# EAGLE design AG_TEX (EAGLE 6.5.0)
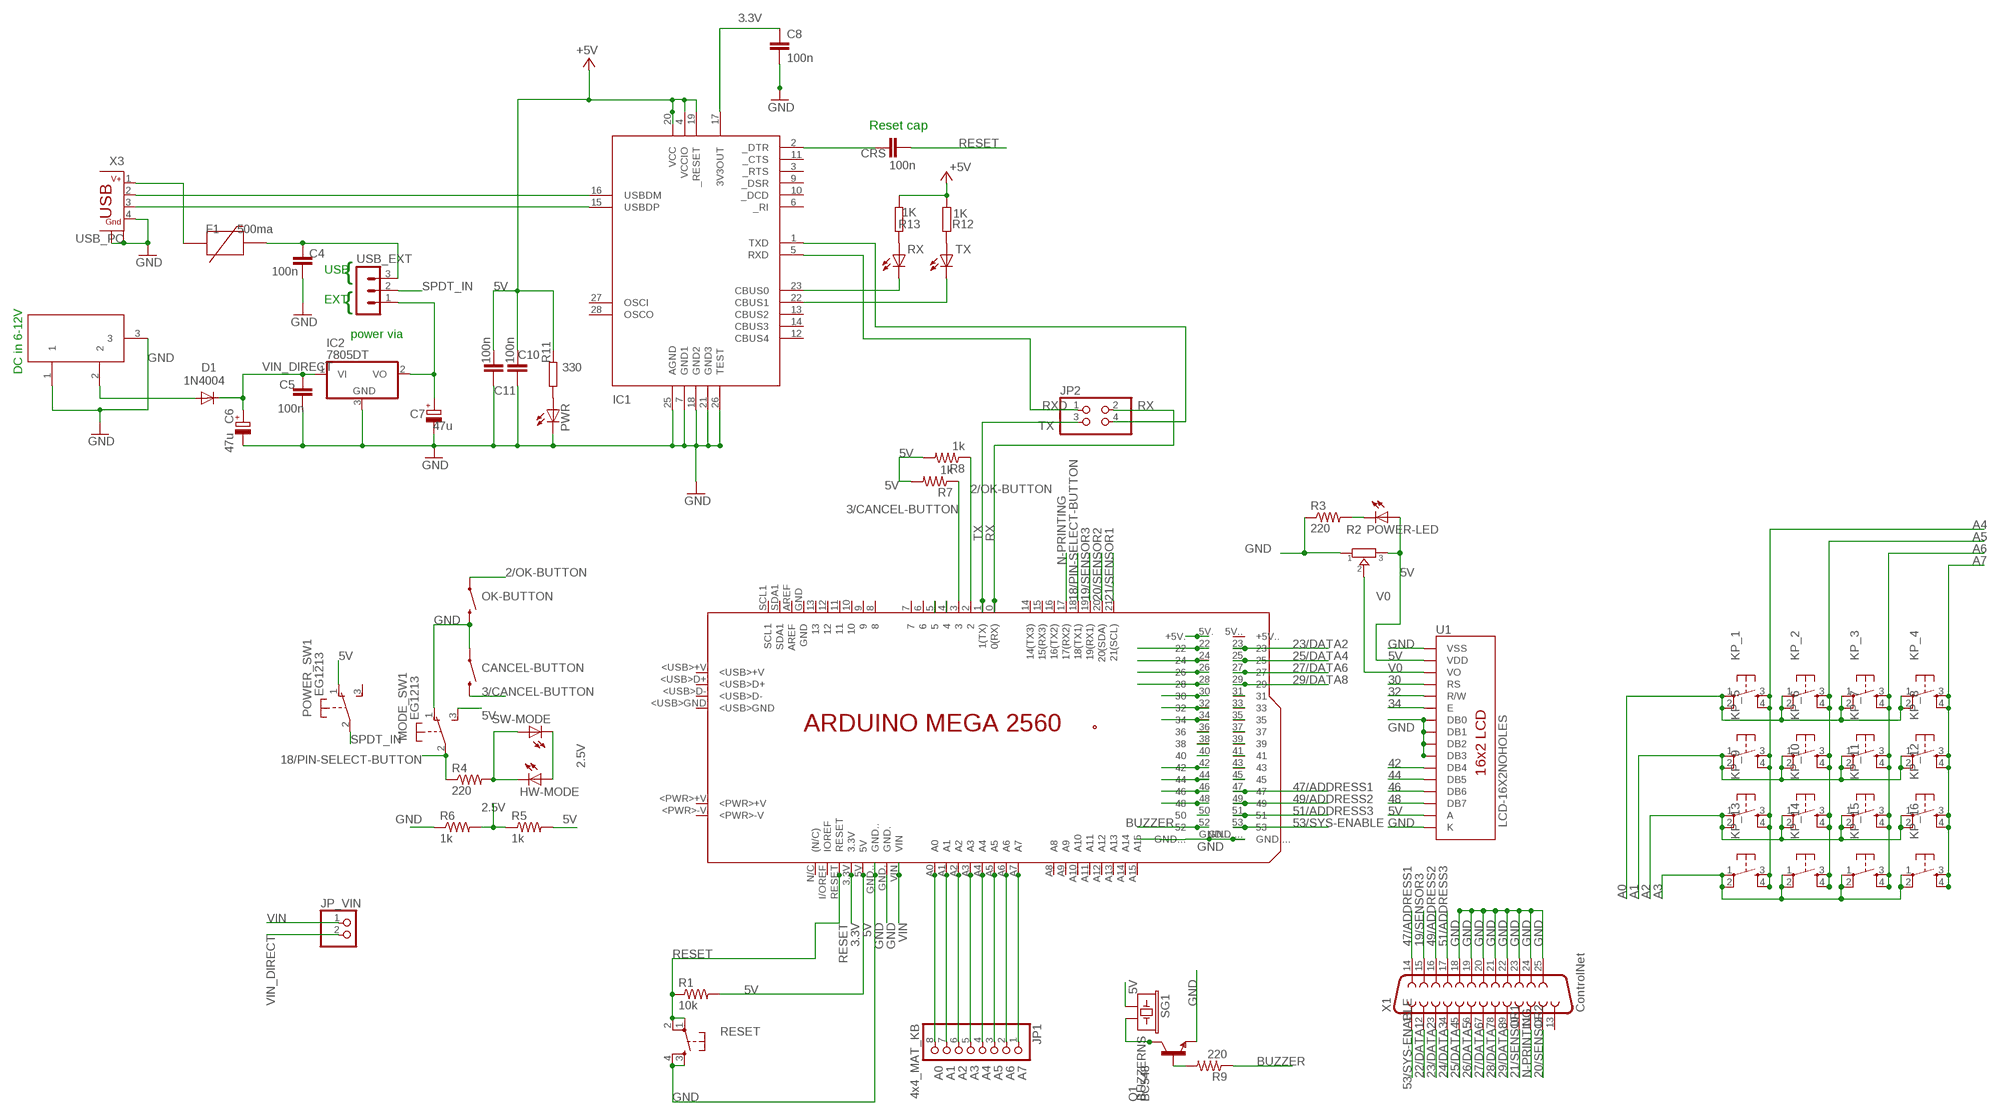
[diagram p0: schematic, sheet 1]

## Parts
C4  100n  C-EU050-024X044  [C050-024X044]
C5  100n  C-EU050-024X044  [C050-024X044]
C6  47u  CPOL-EUE3.5-8  [E3,5-8]
C7  47u  CPOL-EUE3.5-8  [E3,5-8]
C8  100n  C-EU050-024X044  [C050-024X044]
C10  100n  C-EU050-024X044  [C050-024X044]
C11  100n  C-EUC1206  [C1206]
CANCEL-BUTTON  SWITCH-MOMENTARY-212MM  [TACTILE-PTH-12MM]
CRS  100n  C-EU050-024X044  [C050-024X044]
D1  1N4004  DIODEPTH  [DIODE-0.4]
DC1  9V in  DC21MMX  [DC-21MM]
F1  500ma  PTCPTH  [PTC]
HW-MODE  LED5MM  [LED5MM]
IC1  FT232RL  FT232RL-PINNED  [SSOP28DB]
IC2  7805DT  [TO252]
JP1  4x4_MAT_KB  PINHD-1X8CLEANBIG  [1X08-CLEANBIG]
JP2  PINHD-2X2  [2X02]
JP_VIN  PINHD-1X2  [1X02]
KP_1  TAC_SWITCHPTH  [TACTILE-PTH]
KP_2  TAC_SWITCHPTH  [TACTILE-PTH]
KP_3  TAC_SWITCHPTH  [TACTILE-PTH]
KP_4  TAC_SWITCHPTH  [TACTILE-PTH]
KP_5  TAC_SWITCHPTH  [TACTILE-PTH]
KP_6  TAC_SWITCHPTH  [TACTILE-PTH]
KP_7  TAC_SWITCHPTH  [TACTILE-PTH]
KP_8  TAC_SWITCHPTH  [TACTILE-PTH]
KP_9  TAC_SWITCHPTH  [TACTILE-PTH]
KP_10  TAC_SWITCHPTH  [TACTILE-PTH]
KP_11  TAC_SWITCHPTH  [TACTILE-PTH]
KP_12  TAC_SWITCHPTH  [TACTILE-PTH]
KP_13  TAC_SWITCHPTH  [TACTILE-PTH]
KP_14  TAC_SWITCHPTH  [TACTILE-PTH]
KP_15  TAC_SWITCHPTH  [TACTILE-PTH]
KP_16  TAC_SWITCHPTH  [TACTILE-PTH]
MODE_SW  EG1213  [EG1213]
OK-BUTTON  SWITCH-MOMENTARY-212MM  [TACTILE-PTH-12MM]
PCB1  ARDUINO_MEGA2560  [ARDUINO_MEGA2560]
POWER-LED  LED5MM  [LED5MM]
POWER_SW  EG1213  [EG1213]
PWR  LED3MM  [LED3MM]
Q1  BC548  [TO92-EBC]
R1  10k  R-US_0204/7  [0204/7]
R2  TRIMMER-3306F  [TRIMMER_3306F]
R3  220  R-US_0204/7  [0204/7]
R4  220  R-US_0204/7  [0204/7]
R5  1k  R-US_0204/7  [0204/7]
R6  1k  R-US_0204/7  [0204/7]
R7  1k  R-US_0204/7  [0204/7]
R8  1k  R-US_0204/7  [0204/7]
R9  220  R-US_0204/7  [0204/7]
R11  330  R-EU_0204/7  [0204/7]
R12  1K  R-EU_0204/7  [0204/7]
R13  1K  R-EU_0204/7  [0204/7]
RESET  TAC_SWITCHPTH  [TACTILE-PTH]
RX  LED3MM  [LED3MM]
SG1  BUZZERNS  [BUZZER-12MM-NS]
SW-MODE  LED5MM  [LED5MM]
TX  LED3MM  [LED3MM]
U1  LCD-16X2NOHOLES  [LCD-16X2_NOHOLES]
USB_EXT  MA03-1  [MA03-1]
X1  ControlNet  F25HP  [F25HP]
X3  USB_PC  CON-USB-B  [USB-WSHIELDPADS]

## Nets
2.5V: HW-MODE.A R5.1 R6.2 SW-MODE.K(C)
2/OK-BUTTON: OK-BUTTON.1 PCB1.2 R8.1
3.3V: C8.1 IC1.17(3V3OUT) PCB1.3.3V
3/CANCEL-BUTTON: CANCEL-BUTTON.3 PCB1.3 R7.1
4: PCB1.4
5: PCB1.5
5V: C10.2 C11.2 IC1.4(VCCIO) IC1.19(_RESET) IC1.20(VCC) MODE_SW.3(1:S) PCB1.5V PCB1.5V.(+5V.) POWER-LED.A POWER_SW.1(1:O) R1.2 R2.3 R5.2 R7.2 R8.2 R11.1 R12.1 R13.1 SG1.+ U1.2(VDD) U1.15(A) ; supply symbol labelled +5V
18/PIN-SELECT-BUTTON: MODE_SW.2(1:P) PCB1.18(18(TX1)) R4.1
19/SENSOR3: PCB1.19(19(RX1)) X1.15
20/SENSOR2: PCB1.20(20(SDA)) X1.12
21/SENSOR1: PCB1.21(21(SCL)) X1.10
22/DATA1: PCB1.22 X1.2
23/DATA2: PCB1.23 X1.3
24/DATA3: PCB1.24 X1.4
25/DATA4: PCB1.25 X1.5
26/DATA5: PCB1.26 X1.6
27/DATA6: PCB1.27 X1.7
28/DATA7: PCB1.28 X1.8
29/DATA8: PCB1.29 X1.9
30: PCB1.30 U1.4(RS)
31: PCB1.31
32: PCB1.32 U1.5(R/W)
33: PCB1.33
34: PCB1.34 U1.6(E)
35: PCB1.35
36: PCB1.36
37: PCB1.37
38: PCB1.38
39: PCB1.39
40: PCB1.40
41: PCB1.41
42: PCB1.42 U1.11(DB4)
43: PCB1.43
44: PCB1.44 U1.12(DB5)
45: PCB1.45
46: PCB1.46 U1.13(DB6)
47/ADDRESS1: PCB1.47 X1.14
48: PCB1.48 U1.14(DB7)
49/ADDRESS2: PCB1.49 X1.16
50: PCB1.50
51/ADDRESS3: PCB1.51 X1.17
53/SYS-ENABLE: PCB1.53 X1.1
A0: JP1.8 KP_1.1 KP_1.2 KP_2.1 KP_2.2 KP_3.1 KP_3.2 KP_4.1 KP_4.2 PCB1.A0
A1: JP1.7 KP_5.1 KP_5.2 KP_6.1 KP_6.2 KP_7.1 KP_7.2 KP_8.1 KP_8.2 PCB1.A1
A2: JP1.6 KP_9.1 KP_9.2 KP_10.1 KP_10.2 KP_11.1 KP_11.2 KP_12.1 KP_12.2 PCB1.A2
A3: JP1.5 KP_13.1 KP_13.2 KP_14.1 KP_14.2 KP_15.1 KP_15.2 KP_16.1 KP_16.2 PCB1.A3
A4: JP1.4 KP_1.3 KP_1.4 KP_5.3 KP_5.4 KP_9.3 KP_9.4 KP_13.3 KP_13.4 PCB1.A4
A5: JP1.3 KP_2.3 KP_2.4 KP_6.3 KP_6.4 KP_10.3 KP_10.4 KP_14.3 KP_14.4 PCB1.A5
A6: JP1.2 KP_3.3 KP_3.4 KP_7.3 KP_7.4 KP_11.3 KP_11.4 KP_15.3 KP_15.4 PCB1.A6
A7: JP1.1 KP_4.3 KP_4.4 KP_8.3 KP_8.4 KP_12.3 KP_12.4 KP_16.3 KP_16.4 PCB1.A7
BUZZER: PCB1.52 R9.1
GND [power]: C4.1 C5.1 C6.- C7.- C8.2 C10.1 C11.1 CANCEL-BUTTON.1 DC1.1 DC1.3 IC1.7(GND1) IC1.18(GND2) IC1.21(GND3) IC1.25(AGND) IC1.26(TEST) IC2.3(GND) MODE_SW.1(1:O) OK-BUTTON.3 PCB1.GND. PCB1.GND.. PCB1.GND... PCB1.GND.... PWR.K(C) Q1.E R2.1 R3.1 R6.1 RESET.3 RESET.4 U1.1(VSS) U1.7(DB0) U1.8(DB1) U1.9(DB2) U1.10(DB3) U1.16(K) X1.18 X1.19 X1.20 X1.21 X1.22 X1.23 X1.24 X1.25 X3.4 X3.SH1(GND) X3.SH2(GND)
JACK_USB_V+ [power]: D1.A DC1.2
N$1: Q1.C SG1.-
N$2: Q1.B R9.2
N$3: POWER-LED.K(C) R3.2
N$4: HW-MODE.K(C) R4.2 SW-MODE.A
N$5: PWR.A R11.2
N$6: CRS.1 IC1.2(_DTR)
N$9 [finepitch]: IC1.16(USBDM) X3.2
N$24 [finepitch]: IC1.15(USBDP) X3.3
N$34: R12.2 TX.A
N$36: R13.2 RX.A
N-PRINTING: PCB1.17(17(RX2)) X1.11
RESET: CRS.2 PCB1.RESET R1.1 RESET.1 RESET.2
RX: JP2.2 PCB1.0(0(RX))
RXD: IC1.5(RXD) JP2.1
RXLED [finepitch]: IC1.22(CBUS1) TX.K(C)
SPDT_EXT: C7.+ IC2.2(VO) USB_EXT.1
SPDT_IN: POWER_SW.2(1:P) USB_EXT.2
TX: JP2.3 PCB1.1(1(TX))
TXD: IC1.1(TXD) JP2.4
TXLED [finepitch]: IC1.23(CBUS0) RX.K(C)
USB_V+ [power]: F1.P$1 X3.1
USB_V++ [power]: C4.2 F1.P$2 USB_EXT.3
V0: R2.2 U1.3(VO)
VIN: JP_VIN.1 PCB1.VIN
VIN_DIRECT: C5.2 C6.+ D1.C IC2.1(VI) JP_VIN.2
Unconnected: IC1.3(_RTS) IC1.6(_RI) IC1.9(_DSR) IC1.10(_DCD) IC1.11(_CTS) IC1.12(CBUS4) IC1.13(CBUS2) IC1.14(CBUS3) IC1.27(OSCI) IC1.28(OSCO) MODE_SW.MT1(MT) MODE_SW.MT2(MT) PCB1.5V..(+5V..) PCB1.6 PCB1.7 PCB1.8 PCB1.9 PCB1.10 PCB1.11 PCB1.12 PCB1.13 PCB1.14(14(TX3)) PCB1.15(15(RX3)) PCB1.16(16(TX2)) PCB1.<PWR>+V PCB1.<PWR>-V PCB1.<USB>+V PCB1.<USB>D+ PCB1.<USB>D- PCB1.<USB>GND PCB1.A8 PCB1.A9 PCB1.A10 PCB1.A11 PCB1.A12 PCB1.A13 PCB1.A14 PCB1.A15 PCB1.AREF PCB1.GND PCB1.I/OREF(IOREF) PCB1.N/C((N/C)) PCB1.SCL1 PCB1.SDA1 POWER_SW.3(1:S) POWER_SW.MT1(MT) POWER_SW.MT2(MT) X1.13

## Notes on the sheet
- Reset cap
- USB
- {
- EXT
- {
- power via
- DC in 6-12V

## Library data of the parts
C4 C5 C8 C10 C11 CRS = rcl:C-EU: CAPACITOR, European symbol
C6 C7 = rcl:CPOL-EU: POLARIZED CAPACITOR, European symbol
CANCEL-BUTTON OK-BUTTON = SparkFun:SWITCH-MOMENTARY-2
D1 = SparkFunEagle-6-6-07:DIODE: Diode These are standard reverse protection diodes and small signal diodes. SMA package can handle up to about 1A. SOD-323 can handle about 200mA. What the SOD-323 package when ordering, there are some mfgs out there that are 5-pin packages.
DC1 = powersupply:DC21MM
F1 = SparkFunEagle-6-6-07:PTC: Resettable Fuse PTC Resettable Fuse. Spark Fun Electronics SKU : COM-08357
HW-MODE POWER-LED SW-MODE = adafruit:LED: LED
IC1 = my-library:FT232RL-PINNED: USB UART FT232RL 4th Generation USB UART (USB <-> Serial) Controller. Spark Fun Electronics SKU : COM-00650
IC2 = linear:78*: Positive VOLTAGE REGULATOR Source: http://cache.national.com/ds/LM/LM78L05.pdf http://www.fairchildsemi.com/ds/LM/LM7805.pdf
JP1 = adafruit:PINHD-1X8: PIN HEADER
JP2 = pinhead:PINHD-2X2: PIN HEADER
JP_VIN = pinhead:PINHD-1X2: PIN HEADER
KP_1-KP_16 RESET = SparkFun-Retired:TAC_SWITCH: Momentary Switch Button commonly used for reset or general input. Spark Fun Electronics SKU : COM-00097 SMT- SWCH-08247
MODE_SW POWER_SW = adafruit:EG1213: E-Switch right-angle slide SPDT Part #EG1213 http://www.ladyada.net/library/eagle
PCB1 = E14_Arduino_revB:ARDUINO_MEGA2560: Device for representing an Arduino Mega 2560 board with a footprint in an EAGLE design. Created by Dave Young for Element14. More EAGLE documentation at: http://www.element14.com/community/community/knode/cadsoft_eagle
PWR RX TX = led:LED: LED
Q1 = transistor-npn:BC548*: NPN Transistor
R1 R3-R9 = resistor:R-US_: RESISTOR, American symbol
R2 = dp_devices:TRIMMER: Trimmer resistor
R11-R13 = rcl:R-EU_: RESISTOR, European symbol
SG1 = SparkFun:BUZZER: Buzzer 12mm Spark Fun Electronics SKU : Comp-Buzzer
U1 = SparkFun-Displays:LCD-16X2: Standard text-only 16x2 parallel input LCD
USB_EXT = con-lstb:MA03-1: PIN HEADER; OC_FARNELL: unknown; OC_NEWARK: unknown
X1 = SparkFun:F25: D-SUB 25 25 Pin male connector. PCB edge mount for regular PCB thicknesses. This connector will connect directly to the back of a PC parallel port or through a normal DB25 extension cable (M/F). SKU: PRT-08287
X3 = mylib4:CON-USB-B: BERG USB connector

## Net classes
0 default: width 0.203 mm, clearance 0.203 mm
1 power: width 0.6 mm, clearance 0.305 mm
2 finepitch: width 0.203 mm, clearance 0.203 mm

## Board
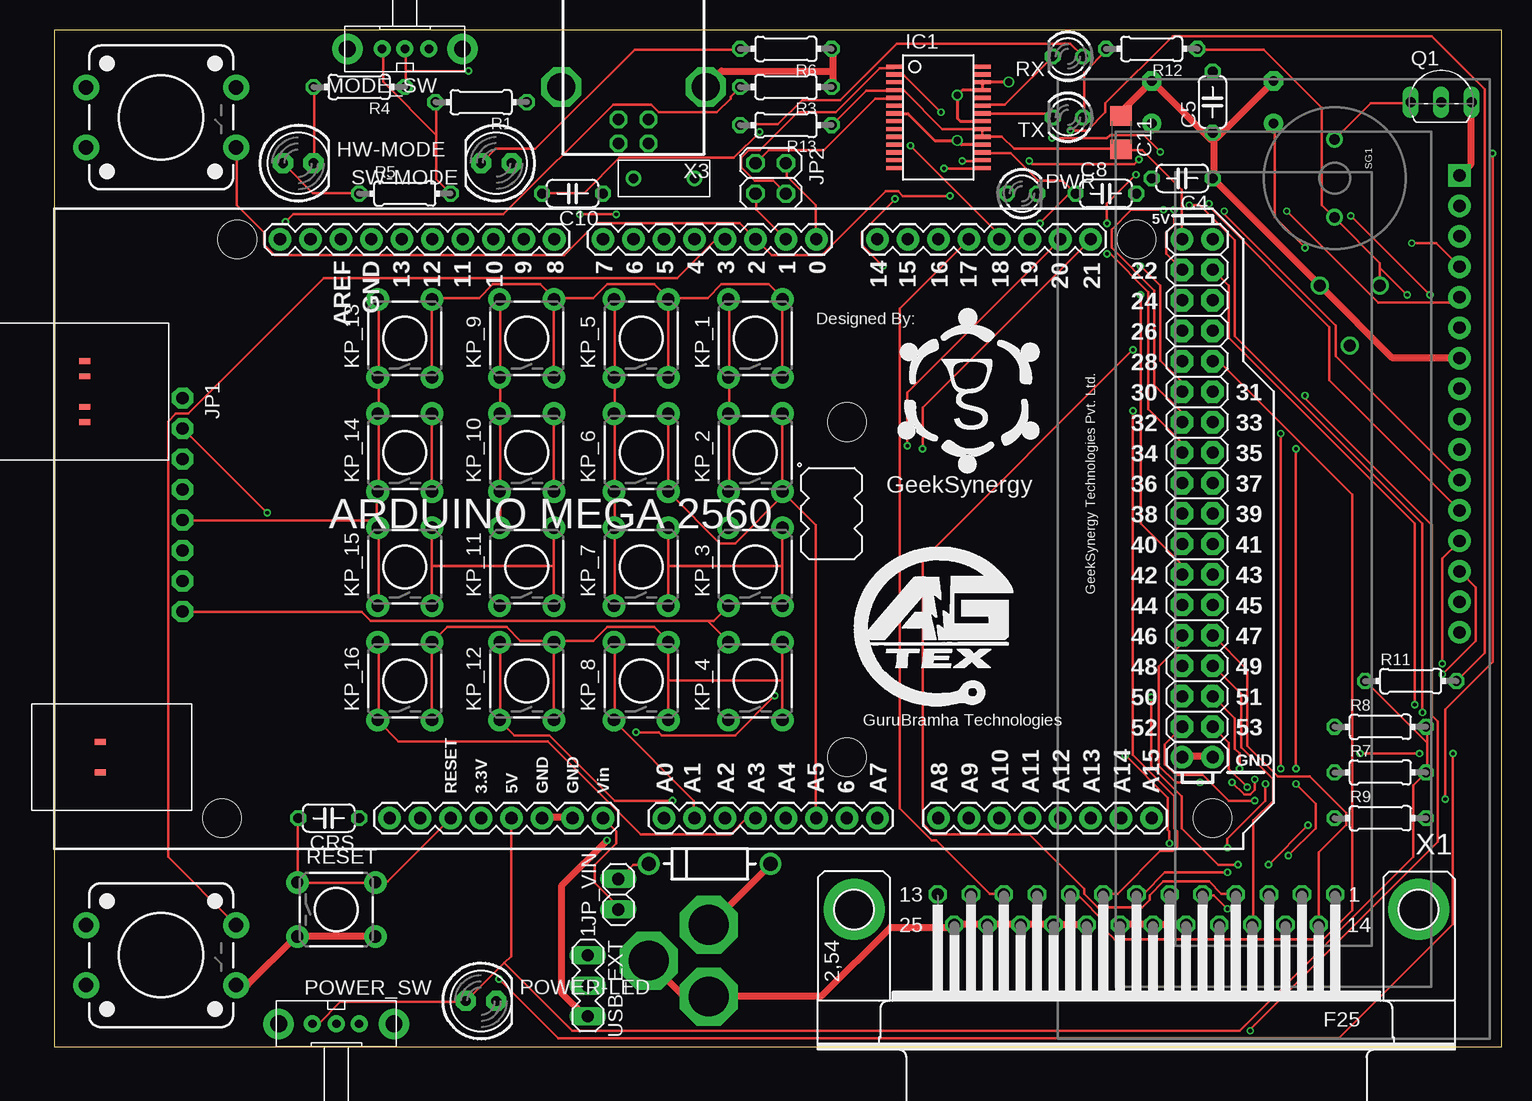
[diagram p1: board, top side]
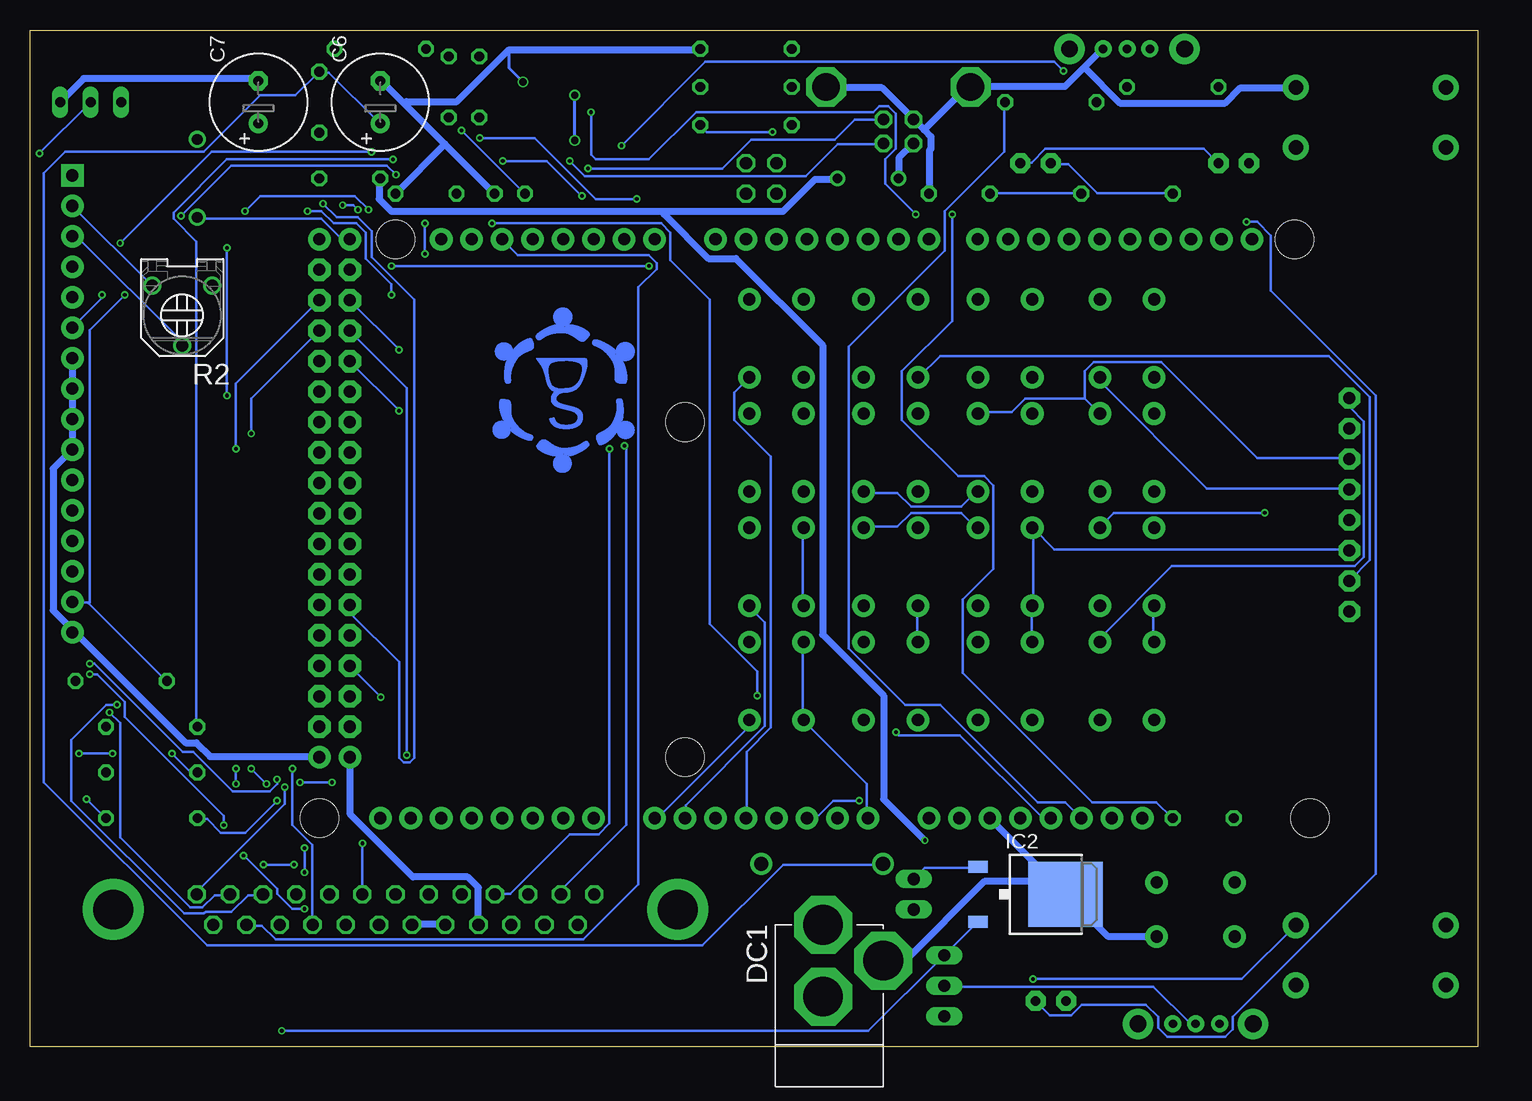
[diagram p2: board, bottom side, seen from below]

Size 120.63 x 84.76 mm. Coordinates in mm from the lower left corner, seen from the top.
Outline: 0,0 120.63,0 120.63,84.76 0,84.76 0,0
Copper layers (1*16): Top 0.035mm / dielectric 1.5mm / Bottom 0.035mm
Design rules "SeeedStudio_2layer_DRU_no_angle_20140221": minimum track width 6mil, minimum drill 12mil, track to track 6mil, track to pad 6mil, pad to pad 6mil, via to via 6mil, smd to smd 0mil, copper to edge 10mil, drill to drill 10mil, minimum pad ring 10mil, minimum via ring 6mil, stop-mask expansion 2mil, vias tented up to drill 100mil, thermal gap 10mil

### Footprints (pad centres in the part's own frame; a part is rotated, then mirrored left to right if it is on the bottom)
C050-024X044 = drill 0.813 octagon: 1 -2.54,0; 2 2.54,0
E3,5-8 = drill 0.813 pad 1.6: + -1.778,0 | drill 0.813 pad 1.6 octagon: - 1.778,0
C1206 = smd 1.6 x 1.8: 1 -1.4,0; 2 1.4,0
TACTILE-PTH-12MM = drill 1.2 pad 2.159: 1 6.25,-2.5; 2 -6.25,-2.5; 3 6.25,2.5; 4 -6.25,2.5
DIODE-0.4 = drill 1.2: A 0,0; C 10.16,0
DC-21MM = drill 3.302 pad 4.826 octagon: 1 -5.08,-3.353; 2 -0.076,-6.35; 3 -0.076,-0.356
PTC = drill 0.8: P$1 -2.54,0; P$2 2.54,0
LED5MM = drill 0.813 pad 1.676 octagon: A -1.27,0; K 1.27,0
SSOP28DB = smd 0.348 x 1.397: 1 -4.225,-3.656; 2 -3.575,-3.656; 3 -2.925,-3.656; 4 -2.275,-3.656; 5 -1.625,-3.656; 6 -0.975,-3.656; 7 -0.325,-3.656; 8 0.325,-3.656; 9 0.975,-3.656; 10 1.625,-3.656; 11 2.275,-3.656; 12 2.925,-3.656; 13 3.575,-3.656; 14 4.225,-3.656; 15 4.225,3.656; 16 3.575,3.656; 17 2.925,3.656; 18 2.275,3.656; 19 1.625,3.656; 20 0.975,3.656; 21 0.325,3.656; 22 -0.325,3.656; 23 -0.975,3.656; 24 -1.625,3.656; 25 -2.275,3.656; 26 -2.925,3.656; 27 -3.575,3.656; 28 -4.225,3.656
TO252 = smd 1 x 1.6: 1 -2.28,-4.8; 2 2.28,-4.8 | smd 5.4 x 6.2: 3 0,2.5
1X08-CLEANBIG = drill 1.016 pad 1.778 octagon: 1 -8.89,0; 2 -6.35,0; 3 -3.81,0; 4 -1.27,0; 5 1.27,0; 6 3.81,0; 7 6.35,0; 8 8.89,0
2X02 = drill 1.016 octagon: 1 -1.27,-1.27; 2 -1.27,1.27; 3 1.27,-1.27; 4 1.27,1.27
1X02 = drill 1.016 long: 1 -1.27,0; 2 1.27,0
TACTILE-PTH = drill 1.016 pad 1.88: 1 -3.251,2.261; 2 3.251,2.261; 3 -3.251,-2.261; 4 3.251,-2.261
EG1213 = drill 0.7 pad 1.422: 1 -2,0; 2 0,0; 3 1.9,0 | drill 1.4 pad 2.54: MT1 -4.8,0; MT2 4.8,0
ARDUINO_MEGA2560 = drill 1.016 pad 1.88: 0 63.5,50.8; 1 60.96,50.8; 2 58.42,50.8; 3 55.88,50.8; 3.3V 35.56,2.54; 4 53.34,50.8; 5 50.8,50.8; 5V 38.1,2.54; 5V. 93.98,50.8; 5V.. 96.52,50.8; 6 48.26,50.8; 7 45.72,50.8; 8 41.656,50.8; 9 39.116,50.8; 10 36.576,50.8; 11 34.036,50.8; 12 31.496,50.8; 13 28.956,50.8; 14 68.58,50.8; 15 71.12,50.8; 16 73.66,50.8; 17 76.2,50.8; 18 78.74,50.8; 19 81.28,50.8; 20 83.82,50.8; 21 86.36,50.8; A0 50.8,2.54; A1 53.34,2.54; A2 55.88,2.54; A3 58.42,2.54; A4 60.96,2.54; A5 63.5,2.54; A6 66.04,2.54; A7 68.58,2.54; A8 73.66,2.54; A9 76.2,2.54; A10 78.74,2.54; A11 81.28,2.54; A12 83.82,2.54; A13 86.36,2.54; A14 88.9,2.54; A15 91.44,2.54; AREF 23.876,50.8; GND 26.416,50.8; GND. 43.18,2.54; GND.. 40.64,2.54; GND... 93.98,7.62; GND.... 96.52,7.62; I/OREF 30.48,2.54; N/C 27.94,2.54; RESET 33.02,2.54; SCL1 18.796,50.8; SDA1 21.336,50.8; VIN 45.72,2.54 | drill 1.016 pad 1.88 octagon: 22 93.98,48.26; 23 96.52,48.26; 24 93.98,45.72; 25 96.52,45.72; 26 93.98,43.18; 27 96.52,43.18; 28 93.98,40.64; 29 96.52,40.64; 30 93.98,38.1; 31 96.52,38.1; 32 93.98,35.56; 33 96.52,35.56; 34 93.98,33.02; 35 96.52,33.02; 36 93.98,30.48; 37 96.52,30.48; 38 93.98,27.94; 39 96.52,27.94; 40 93.98,25.4; 41 96.52,25.4; 42 93.98,22.86; 43 96.52,22.86; 44 93.98,20.32; 45 96.52,20.32; 46 93.98,17.78; 47 96.52,17.78; 48 93.98,15.24; 49 96.52,15.24; 50 93.98,12.7; 51 96.52,12.7; 52 93.98,10.16; 53 96.52,10.16 | smd 1.016 x 0.508: <PWR>+V 3.81,8.89; <PWR>-V 3.81,6.35; <USB>+V 2.54,40.64; <USB>D+ 2.54,39.37; <USB>D- 2.54,36.83; <USB>GND 2.54,35.56 | hole 3.2: 15.24,50.8; 13.97,2.54; 66.04,35.56; 66.04,7.62; 90.17,50.8; 96.52,2.54
LED3MM = drill 0.813 octagon: A -1.27,0; K 1.27,0
TO92-EBC = drill 0.813 long: B 0,-1.27; C -2.54,-1.27; E 2.54,-1.27
0204/7 = drill 0.813 octagon: 1 -3.81,0; 2 3.81,0
TRIMMER_3306F = drill 1: 1 -2.5,-2.5; 2 0,2.5; 3 2.5,-2.5
BUZZER-12MM-NS = drill 0.9: + 3.25,0; - -3.25,0
LCD-16X2_NOHOLES = drill 1.016 pad 1.88 square: 1 -32,15.5 | drill 1.016 pad 1.88: 2 -29.46,15.5; 3 -26.92,15.5; 4 -24.38,15.5; 5 -21.84,15.5; 6 -19.3,15.5; 7 -16.76,15.5; 8 -14.22,15.5; 9 -11.68,15.5; 10 -9.14,15.5; 11 -6.6,15.5; 12 -4.06,15.5; 13 -1.52,15.5; 14 1.02,15.5; 15 3.56,15.5; 16 6.1,15.5
MA03-1 = drill 1.016 long: 1 -2.54,0; 2 0,0; 3 2.54,0
F25HP = drill 1.016 octagon: 1 -16.561,-1.27; 2 -13.792,-1.27; 3 -11.049,-1.27; 4 -8.28,-1.27; 5 -5.512,-1.27; 6 -2.769,-1.27; 7 0,-1.27; 8 2.769,-1.27; 9 5.512,-1.27; 10 8.28,-1.27; 11 11.049,-1.27; 12 13.792,-1.27; 13 16.561,-1.27; 14 -15.189,1.27; 15 -12.421,1.27; 16 -9.652,1.27; 17 -6.909,1.27; 18 -4.14,1.27; 19 -1.372,1.27; 20 1.372,1.27; 21 4.14,1.27; 22 6.909,1.27; 23 9.652,1.27; 24 12.421,1.27; 25 15.189,1.27 | drill 3.302 pad 5.08: G1 -23.52,0; G2 23.52,0
USB-WSHIELDPADS = drill 0.95 octagon: 1 1.25,4.71; 2 -1.25,4.71; 3 -1.25,2.71; 4 1.25,2.71 | drill 2.3 octagon: SH1 -6.02,0; SH2 6.02,0

### Placement (x,y rotation side)
C4  93.98,72.39 180 top
C5  96.52,78.74 90 top
C6  91.44,78.74 90 bottom
C7  101.6,78.74 90 bottom
C8  87.63,71.12 0 top
C10  43.18,71.12 180 top
C11  88.9,76.2 270 top
CANCEL-BUTTON  8.89,7.62 0 top
CRS  22.86,19.05 180 top
D1  59.69,15.24 180 top
DC1  54.61,3.81 180 bottom
F1  50.8,72.39 0 top
HW-MODE  20.32,73.66 0 top
IC1  73.66,77.47 270 top
IC2  36.83,12.7 270 bottom
JP1  10.68,45.18 270 top
JP2  59.69,72.39 270 top
JP_VIN  46.99,12.7 90 top
KP_1  58.42,59.05 90 top
KP_2  58.42,49.53 90 top
KP_3  58.42,40.01 90 top
KP_4  58.42,30.48 90 top
KP_5  48.9,59.05 90 top
KP_6  48.9,49.53 90 top
KP_7  48.9,40.01 90 top
KP_8  48.9,30.48 90 top
KP_9  39.37,59.05 90 top
KP_10  39.37,49.53 90 top
KP_11  39.37,40.01 90 top
KP_12  39.37,30.48 90 top
KP_13  29.21,59.05 90 top
KP_14  29.21,49.53 90 top
KP_15  29.21,40.01 90 top
KP_16  29.21,30.48 90 top
MODE_SW  29.21,83.19 180 top
OK-BUTTON  8.89,77.47 0 top
PCB1  0,16.51 0 top
POWER-LED  35.56,3.81 0 top
POWER_SW  23.5,1.91 0 top
PWR  80.64,71.12 0 top
Q1  115.57,80.01 0 top
R1  35.56,78.74 180 top
R2  107.95,60.96 180 bottom
R3  60.96,80.01 180 top
R4  25.4,80.01 180 top
R5  29.21,71.12 0 top
R6  60.96,83.19 180 top
R7  110.49,22.86 0 top
R8  110.49,26.67 0 top
R9  110.49,19.05 0 top
R11  113.03,30.48 0 top
R12  91.44,83.19 180 top
R13  60.96,76.84 180 top
RESET  23.5,11.43 0 top
RX  84.45,82.55 180 top
SG1  106.68,72.39 270 top
SW-MODE  36.83,73.66 180 top
TX  84.45,77.47 180 top
U1  101.6,40.64 270 top
USB_EXT  44.45,5.08 270 top
X1  90.17,11.43 180 top
X3  48.26,80.01 180 top

### Tracks (layer width: path | path; a pad name or v marks a point on that pad's centre or on a via)
2.5V
  Top 0.203: R5.1 25.36,71.18 21.55,71.18 19.14,73.59 HW-MODE.A | R6.2 57.11,83.11 48.35,83.11 40.09,74.86 36.79,74.86 35.65,73.72 SW-MODE.K
  Bottom 0.203: R5.1 25.49,71.18 31.71,71.18 34.12,73.59 35.52,73.59 SW-MODE.K
2/OK-BUTTON  (via drill 0.3)
  Top 0.203: v90.38,73.97 90,73.59 81.49,73.59 v81.24,73.84 | v74.64,70.92 70.7,70.92 70.32,71.3 69.3,71.3 63.97,65.97 59.78,65.97 58.51,67.24 PCB1.2 58.38,67.37 57.11,68.64 45.17,68.64 42.5,65.97 18.37,65.97 17.49,66.86 17.49,67.87 15.2,70.16 15.2,74.86 OK-BUTTON.1
  Bottom 0.203: v90.38,73.97 104.23,73.97 108.67,69.52 108.67,69.02 106.77,67.11 106.77,26.73 R8.1 | v81.24,73.84 77.56,73.84 v74.64,70.92
3.3V  (via drill 0.3)
  Top 0.203: IC1.17 77.43,74.48 79.72,74.48 82,72.19 84.03,72.19 85.05,71.18 C8.1 84.8,71.3 v82.13,68.64 | v48.47,26.22 50.38,26.22 50.63,25.96 56.73,25.96 v60.03,29.27
  Bottom 0.203: v48.47,26.22 48.22,25.96 43.14,25.96 36.28,19.11 35.65,19.11 PCB1.3.3V | v60.03,29.27 60.03,31.3 63.97,35.23 63.97,62.29 67.27,65.59 67.27,67.87 68.03,68.64 v82.13,68.64
3/CANCEL-BUTTON  (via drill 0.3)
  Top 0.203: v113.75,24.44 v108.8,24.44 | v116.55,24.44 116.55,10.22 107.02,0.69 42,0.69 v37.04,5.64 | PCB1.3 55.84,67.24 55.08,67.24 51.9,64.06 22.44,64.06 11.14,52.76 10.12,52.76 9.48,52.13 9.48,15.8 15.07,10.22 CANCEL-BUTTON.3
  Bottom 0.203: v108.8,24.44 107.27,22.92 106.77,22.92 R7.1 | v116.55,24.44 v113.75,24.44 | v37.04,5.64 19.64,5.64 15.2,10.09 CANCEL-BUTTON.3
5V  (via drill 0.3)
  Top 0.203: 31.84,76 31.84,72.32 32.98,71.18 R5.2 | 31.84,76 31.84,78.67 R1.2 | 31.84,76 27.39,80.45 27.39,83.11 MODE_SW.3 | PCB1.5V. 93.94,67.37 93.94,71.43 90.64,74.73 88.99,74.73 C11.2 88.86,74.86 79.97,74.86 78.95,75.87 77.43,75.87 IC1.19 77.3,75.87 77.3,76.38 IC1.20 77.3,76.51 74,76.51 70.83,79.68 70.06,79.68 IC1.4 69.94,79.68 67.65,79.68 64.86,76.89 R13.1 | v58.76,76.26 56.6,74.1 47.08,74.1 44.16,71.18 40.73,71.18 C10.2 | POWER_SW.1 21.55,1.96 22.06,1.96 23.84,3.74 34.25,3.74 POWER-LED.A 34.38,3.87 37.49,6.98 | 37.49,6.98 38.06,7.55 38.06,18.98 PCB1.5V | 114.39,25.33 114.39,26.6 R8.2 | 114.39,25.33 114.39,22.92 R7.2 114.26,22.79 113.24,21.77 113.24,15.8 98.77,1.33 43.14,1.33 37.49,6.98 | 114.39,25.33 109.31,30.41 R11.1 | R12.1 95.34,83.11 100.8,83.11 105.62,78.29 105.62,70.16 106.64,69.14 SG1.+ 106.77,69.02 110.45,65.33 110.45,64.95 | 110.45,64.95 110.45,63.56 R2.3 | 110.45,64.95 v112.74,62.67
  Bottom 0.203: R5.2 33.11,71.18 40.6,71.18 C10.2 | v58.76,76.26 64.22,76.26 64.73,76.76 R13.1 | 115.72,36.95 109.31,30.54 R11.1 | 115.72,36.95 115.78,37.01 117.05,37.01 U1.15 | U1.2 117.05,70.03 110.58,63.56 R2.3 | v112.74,62.67 115.66,59.75 115.66,37.01 115.72,36.95 | PCB1.5V. 94.07,67.37 94.7,67.37 96.35,69.02 106.64,69.02 SG1.+
18/PIN-SELECT-BUTTON  (via drill 0.3)
  Top 0.203: 29.3,81.34 29.3,83.11 MODE_SW.2 | 29.3,81.34 29.3,80.07 R4.1 | v71.33,75.11 78.7,67.75 78.7,67.37 PCB1.18 | 29.3,81.34 v34.5,81.34
  Bottom 0.203: v71.33,75.11 64.35,82.1 35.27,82.1 v34.5,81.34
19/SENSOR3
  Bottom 0.203: X1.15 102.58,10.09 101.31,10.09 100.16,8.95 74.51,8.95 69.94,13.52 69.94,63.3 68.41,64.83 68.41,65.33 69.05,65.97 79.97,65.97 81.24,67.24 PCB1.19
20/SENSOR2  (via drill 0.3)
  Top 0.203: v71.08,50.09 71.08,54.54 83.78,67.24 PCB1.20
  Bottom 0.203: v71.08,50.09 70.95,49.97 70.95,18.47 76.29,13.14 76.29,12.76 X1.12
21/SENSOR1  (via drill 0.3)
  Top 0.203: v72.35,49.84 72.35,53.27 86.32,67.24 PCB1.21
  Bottom 0.203: v72.35,49.84 72.35,18.6 73.24,17.71 75.65,17.71 80.6,12.76 81.87,12.76 X1.10
22/DATA1  (via drill 0.3)
  Top 0.203: v114.01,27.87 114.01,43.62 98.38,59.24 98.38,67.24 95.46,70.16 v94.57,70.16 | v93.3,69.78 93.3,68.51 92.67,67.87 92.67,66.1 93.94,64.83 PCB1.22
  Bottom 0.203: v114.01,27.87 113.12,26.98 113.12,17.45 107.27,11.61 106.26,11.61 105.24,12.63 103.97,12.63 X1.2 | v94.57,70.16 93.69,70.16 v93.3,69.78
23/DATA2  (via drill 0.3)
  Top 0.203: v113.37,28.5 113.37,43.62 97.88,59.11 97.88,63.43 96.61,64.7 PCB1.23
  Bottom 0.203: v113.37,28.5 114.26,28.5 117.18,25.58 117.18,20.5 107.78,11.1 106.13,11.1 106,11.23 103.85,11.23 102.45,12.63 101.31,12.63 X1.3
24/DATA3  (via drill 0.3)
  Top 0.203: v89.88,58.09 72.35,40.57 72.35,18.6 73.24,17.71 81.24,17.71 85.81,13.14 85.81,12.76 86.95,11.61 90.64,11.61 91.27,12.25 91.27,12.63 92.42,13.77 96.23,13.77 97.24,12.76 98.38,12.76 X1.4
  Bottom 0.203: v89.88,58.09 93.94,62.16 PCB1.24
25/DATA4  (via drill 0.3)
  Top 0.203: v97.75,11.49 96.61,12.63 95.72,12.63 X1.5 | v102.83,15.93 105.12,18.22 105.12,20.25 v103.46,21.9 | v103.46,49.84 v103.46,23.17
  Bottom 0.203: v97.75,11.49 98.77,11.49 100.04,12.76 100.04,13.14 v102.83,15.93 | v103.46,23.17 v103.46,21.9 | v103.46,49.84 103.46,55.3 96.61,62.16 PCB1.25
26/DATA5  (via drill 0.3)
  Top 0.203: v92.92,16.95 92.92,17.96 92.8,18.09 92.8,20.76 v89.24,24.31
  Bottom 0.203: v92.92,16.95 92.92,12.76 X1.6 | v89.24,24.31 89.24,54.92 93.94,59.62 PCB1.26
27/DATA6  (via drill 0.3)
  Top 0.203: v97.75,14.53 92.54,14.53 90.76,12.76 90.26,12.76 X1.7 | v97.75,16.57 97.75,17.33 100.92,20.5 v100.92,21.9 | v102.19,51.11 v102.19,23.17
  Bottom 0.203: v97.75,16.57 v97.75,14.53 | v102.19,23.17 v100.92,21.9 | v102.19,51.11 102.19,54.03 96.61,59.62 PCB1.27
28/DATA7  (via drill 0.3)
  Top 0.203: v89.88,53.01 89.88,24.31 93.3,20.88 93.3,18.22 93.56,17.96 93.56,16.69 93.18,16.31 92.16,16.31 88.61,12.76 87.46,12.76 X1.8
  Bottom 0.203: v89.88,53.01 93.94,57.08 PCB1.28
29/DATA8
  Top 0.203: X1.9 84.67,12.63 85.3,12.63 87.59,10.34 87.59,9.71 88.35,8.95 105.75,8.95 108.16,11.36 108.16,46.03 97.11,57.08 96.61,57.08 PCB1.29
30  (via drill 0.3)
  Top 0.203: v90.51,65.08 92.16,63.43 92.16,57.21 93.94,55.43 93.94,54.67 PCB1.30 | v69.05,65.08 67.27,66.86 67.27,67.87 v70.06,70.67 | v83.14,75.75 87.72,75.75 87.97,76 90.76,76 v92.16,74.6 | v113.12,66.98 115.15,66.98 117.05,65.08 U1.4
  Bottom 0.203: v69.05,65.08 v90.51,65.08 | v70.06,70.67 73.49,70.67 78.57,75.75 v83.14,75.75 | v92.16,74.6 105.5,74.6 v113.12,66.98
32  (via drill 0.3)
  Top 0.203: v92.42,69.78 89.75,69.78 88.1,68.13 88.1,66.6 91.65,63.05 91.65,55.17 93.94,52.89 93.94,52.13 PCB1.32 | v102.7,69.65 110.32,62.03 116.67,62.03 117.05,62.41 U1.5
  Bottom 0.203: v92.42,69.78 93.56,70.92 101.43,70.92 v102.7,69.65
34  (via drill 0.3)
  Top 0.203: v87.72,66.1 87.97,66.1 91.15,62.92 91.15,53.14 93.94,50.35 93.94,49.59 PCB1.34 | v87.72,68.64 87.72,70.29 v90.13,72.7 | v114.64,62.67 v108.04,69.27
  Bottom 0.203: v87.72,68.64 v87.72,66.1 | v90.13,72.7 90.89,73.46 103.85,73.46 v108.04,69.27 | v114.64,62.67 114.64,62.41 117.05,60 U1.6
42  (via drill 0.3)
  Top 0.203: v90.51,62.67 90.51,43.62 93.94,40.19 93.94,39.43 PCB1.42 | v97.5,69.65 97.5,69.4 106.77,60.13 106.77,57.59 117.05,47.3 U1.11
  Bottom 0.203: v90.51,62.67 90.51,63.56 92.67,65.71 92.67,67.87 93.43,68.64 95.34,68.64 96.35,69.65 v97.5,69.65
44  (via drill 0.3)
  Top 0.203: v96.23,70.29 96.23,70.03 106.26,60 106.26,55.55 117.05,44.76 U1.12
  Bottom 0.203: v96.23,70.29 95.08,69.14 93.3,69.14 92.16,68 92.16,65.84 88.61,62.29 88.61,24.06 88.99,23.68 89.49,23.68 89.88,24.06 89.88,32.06 93.94,36.12 93.94,36.76 PCB1.44
46  (via drill 0.3)
  Top 0.203: v95.46,22.03 93.43,22.03 92.03,23.42 92.03,31.68 93.94,33.58 93.94,34.22 PCB1.46 | v98.13,22.03 99.15,21.01 99.65,21.01 100.04,21.39 v100.04,22.28 | v115.66,31.93 115.66,40.7 117.05,42.09 U1.13
  Bottom 0.203: v98.13,22.03 v95.46,22.03 | v100.04,22.28 100.04,21.9 100.67,21.26 103.72,21.26 107.02,24.57 107.91,24.57 115.28,31.93 v115.66,31.93
47/ADDRESS1
  Top 0.203: X1.14 105.37,10.22 105.37,16.18 107.66,18.47 107.66,19.49 104.61,22.53 101.94,22.53 99.4,25.07 99.4,31.42 96.61,34.22 PCB1.47
48  (via drill 0.3)
  Top 0.203: v91.4,29.14 91.4,23.42 93.94,20.88 93.94,18.22 96.99,15.17 v98.64,15.17 | v104.48,18.47 v101.18,15.17 | v115.66,31.04 118.45,33.84 118.45,38.28 117.18,39.55 U1.14
  Bottom 0.203: v91.4,29.14 93.94,31.68 PCB1.48 | v101.18,15.17 v98.64,15.17 | v104.48,18.47 104.48,19.23 112.74,27.49 112.74,28.76 115.02,31.04 v115.66,31.04
49/ADDRESS2
  Top 0.203: X1.16 99.91,10.22 99.91,18.85 101.56,20.5 101.56,22.28 98.89,24.95 98.89,29.39 96.61,31.68 PCB1.49
51/ADDRESS3  (via drill 0.3)
  Top 0.203: v98.77,23.17 98.77,24.44 98.38,24.82 98.38,27.36 96.61,29.14 PCB1.51
  Bottom 0.203: v98.77,23.17 98.77,18.47 97.11,16.82 97.11,10.22 X1.17
53/SYS-ENABLE  (via drill 0.3)
  Top 0.203: v99.4,21.65 97.88,23.17 97.88,25.33 96.61,26.6 PCB1.53
  Bottom 0.203: v99.4,21.65 99.4,20.25 106.64,13.01 106.64,12.76 X1.1
A0
  Top 0.203: KP_1.2 56.22,62.29 56.22,55.81 KP_1.1 56.22,55.68 56.22,52.89 KP_2.2 56.22,52.76 56.22,46.28 KP_2.1 56.22,46.16 56.22,43.36 KP_3.2 | 54.44,35.49 54.95,35.49 56.09,36.63 KP_3.1 | 54.44,35.49 26.38,35.49 25.61,36.25 10.75,36.25 JP1.8 | 54.44,35.49 56.09,33.84 KP_4.2
  Bottom 0.203: PCB1.A0 50.89,19.11 50.89,21.9 56.09,27.11 KP_4.1 56.22,27.23 56.22,33.71 KP_4.2 | KP_3.2 56.22,43.24 56.22,36.76 KP_3.1
A1
  Top 0.203: KP_8.2 46.7,33.71 46.7,27.23 KP_8.1 46.7,27.11 53.3,20.5 53.3,19.11 PCB1.A1 | KP_7.1 46.7,36.76 46.7,43.24 KP_7.2 46.7,43.36 46.7,46.16 KP_6.1 46.7,46.28 46.7,52.76 KP_6.2 46.7,52.89 46.7,55.68 KP_5.1 46.7,55.81 46.7,62.29 KP_5.2
  Bottom 0.203: KP_7.1 46.7,36.63 46.7,33.84 KP_8.2 | JP1.7 10.63,38.92 8.98,40.57 8.98,54.16 12.41,57.59 44.79,57.59 46.57,55.81 KP_5.1
A2  (via drill 0.3)
  Top 0.203: KP_12.2 37.17,33.71 37.17,27.23 KP_12.1 37.17,27.11 38.31,25.96 41.23,25.96 46.7,20.5 v51.52,20.5 | KP_9.2 37.17,62.29 37.17,55.81 KP_9.1 37.17,55.68 37.17,52.89 KP_10.2 37.17,52.76 37.17,46.28 KP_10.1 37.17,46.16 37.17,43.36 KP_11.2
  Bottom 0.203: KP_12.2 37.17,33.84 37.17,36.63 KP_11.1 37.04,36.76 37.04,43.11 KP_11.2 37.04,43.24 35.27,41.46 10.75,41.46 JP1.6 | v51.52,20.5 53.68,20.5 55.08,19.11 55.84,19.11 PCB1.A2
A3
  Top 0.203: KP_13.2 27.01,62.29 27.01,55.81 KP_13.1 27.01,55.68 27.01,52.89 KP_14.2 27.01,52.76 27.01,46.28 KP_14.1 26.88,46.16 26.88,43.49 KP_15.2 | JP1.5 10.75,43.87 26.38,43.87 26.88,43.36 KP_15.2 | KP_16.2 27.01,33.71 27.01,27.23 KP_16.1 27.01,27.11 28.66,25.46 41.11,25.46 48.85,17.71 56.35,17.71 57.62,18.98 58.38,18.98 PCB1.A3 | KP_15.2 27.01,43.24 27.01,36.76 KP_15.1
  Bottom 0.203: KP_15.1 27.01,36.63 27.01,33.84 KP_16.2
A4
  Top 0.203: KP_13.3 31.46,55.81 31.46,62.29 KP_13.4 31.58,62.41 35.39,62.41 36.54,63.56 40.47,63.56 41.62,62.41 KP_9.4 | KP_9.3 41.62,55.81 41.62,62.29 KP_9.4 | KP_5.3 51.14,55.81 51.14,62.29 KP_5.4 | KP_9.4 41.74,62.41 44.92,62.41 46.06,63.56 50,63.56 51.14,62.41 KP_5.4 | KP_1.3 60.67,55.81 60.67,62.29 KP_1.4 60.67,62.41 59.52,63.56 55.59,63.56 54.44,62.41 51.27,62.41 KP_5.4
  Bottom 0.203: JP1.4 10.75,46.54 22.57,46.54 31.46,55.43 31.46,55.68 KP_13.3 | PCB1.A4 60.92,19.11 60.92,24.57 58.89,26.6 58.89,49.2 61.94,52.25 61.94,54.54 60.79,55.68 KP_1.3
A5
  Top 0.203: KP_2.3 60.67,46.28 60.67,52.76 KP_2.4 | PCB1.A5 63.46,19.11 63.46,43.49 60.79,46.16 KP_2.3 | KP_6.4 51.14,52.76 51.14,46.28 KP_6.3 51.27,46.16 55.46,41.97 56.73,41.97 60.79,46.03 KP_2.3 | KP_10.3 41.62,46.28 41.62,52.76 KP_10.4 | KP_14.3 31.46,46.28 31.46,52.76 KP_14.4
  Bottom 0.203: 32.73,54.03 32.73,56.32 31.96,57.08 26.38,57.08 18.37,49.08 10.75,49.08 JP1.3 | 32.73,54.03 31.58,52.89 KP_14.4 | 32.73,54.03 37.68,54.03 38.82,52.89 41.62,52.89 KP_10.4 | KP_6.3 51.14,46.16 48.35,46.16 47.2,45.01 43.01,45.01 41.74,46.28 KP_10.3
A6  (via drill 0.3)
  Top 0.203: 51.14,40.06 51.14,43.24 KP_7.4 | 51.14,40.06 51.14,36.76 KP_7.3 | 60.67,40.06 60.67,43.24 KP_3.4 | 60.67,40.06 60.67,36.76 KP_3.3 | 60.67,40.06 51.14,40.06 | 41.62,40.06 41.62,43.24 KP_11.4 | 41.62,40.06 41.62,36.76 KP_11.3 | v17.74,44.51 10.75,51.49 JP1.2 | 31.46,40.06 31.46,43.24 KP_15.4 | 31.46,40.06 31.46,36.76 KP_15.3 | 31.46,40.06 41.62,40.06
  Bottom 0.203: PCB1.A6 66,19.11 66,20.12 59.4,26.73 59.4,35.36 60.67,36.63 KP_3.3 | v17.74,44.51 30.31,44.51 31.46,43.36 KP_15.4 | KP_7.4 51.14,43.36 48.35,43.36 47.2,44.51 43.01,44.51 41.74,43.24 KP_11.4
A7
  Top 0.203: KP_12.3 41.62,27.23 41.62,33.71 KP_12.4 | 51.14,30.54 51.14,33.71 KP_8.4 51.14,33.84 50,34.98 46.06,34.98 44.92,33.84 41.74,33.84 KP_12.4 | 51.14,30.54 51.14,27.23 KP_8.3 | 60.67,30.54 60.67,33.71 KP_4.4 | 60.67,30.54 60.67,27.23 KP_4.3 | 60.67,30.54 51.14,30.54 | KP_16.3 31.46,27.23 31.46,33.71 KP_16.4 31.58,33.84 32.73,34.98 37.68,34.98 38.82,33.84 41.62,33.84 KP_12.4
  Bottom 0.203: PCB1.A7 68.54,19.11 68.29,19.11 60.79,26.6 60.79,27.11 KP_4.3 | JP1.1 10.63,54.03 10.63,53.27 9.48,52.13 9.48,40.82 10.25,40.06 25.49,40.06 31.46,34.09 31.46,33.84 KP_16.4
BUZZER  (via drill 0.3)
  Top 0.203: v100.04,20.5 97.88,20.5 95.72,22.66 93.43,22.66 92.54,23.55 92.54,25.2 93.94,26.6 PCB1.52
  Bottom 0.203: v100.04,20.5 102.7,17.84 104.73,17.84 105.88,18.98 106.64,18.98 R9.1
GND  (via drill 0.6)
  Top 0.254: v79.54,80.42 77.34,80.42 | IC1.26 IC1.25 75.68,79.74 v75.25,79.31 75.25,77.39 75.26,77.38 75.27,77.38 75.49,77.15 IC1.21 | IC1.18 75.6,75.19 v75.24,75.55 v75.23,75.55 73.36,75.55 71.12,77.79 IC1.7
  Top 0.406: 77.34,80.42 IC1.26
  Top 0.6: X1.20 88.86,10.22 91.53,10.22 X1.19 91.78,10.22 94.19,10.22 X1.18 | PCB1.GND... 94.07,24.19 96.48,24.19 PCB1.GND.... | X1.21 85.94,10.22 83.53,10.22 X1.22 83.14,10.22 80.6,10.22 X1.23 80.22,10.22 77.94,10.22 X1.24 77.68,10.22 75.02,10.22 X1.25 74.76,9.96 69.68,9.96 63.97,4.25 54.82,4.25 DC1.3 54.44,4.25 52.41,4.25 49.62,7.04 DC1.1 | RESET.4 26.63,9.2 20.28,9.2 RESET.3 20.03,9.07 16.09,5.14 15.2,5.14 CANCEL-BUTTON.1 | PCB1.GND.. 40.73,19.11 43.14,19.11 PCB1.GND. | 64.86,81.34 64.86,83.11 R6.1 | 64.86,81.34 64.86,80.07 R3.1 | 64.86,81.34 55.59,81.34 54.32,80.07 X3.SH1 | C11.1 88.99,77.65 88.99,78.03 91.4,80.45 C6.- 91.65,80.32 96.35,75.62 C5.1 | Q1.E 118.07,78.67 118.07,73.59 117.18,72.7 U1.1 | C5.1 96.61,76.13 96.61,72.45 C4.1 96.73,72.19 105.37,63.56 R2.1 105.62,63.3 111.47,57.46 117.05,57.46 U1.7 | C7.- 101.56,80.45 96.86,75.75 C5.1
  Bottom 0.254: 80.73,83.11 80.73,81.61 v79.54,80.42 | v75.25,75.56 v75.25,79.31
  Bottom 0.305: v75.25,75.56 v75.24,75.55
  Bottom 0.6: PCB1.GND... 93.94,24.06 93.94,19.36 88.73,14.15 84.16,14.15 83.27,13.26 83.27,10.22 X1.22 | X1.20 88.73,10.22 86.07,10.22 X1.21 | PCB1.GND.. 40.6,18.98 34.38,12.76 IC2.3 | RESET.4 26.76,9.2 30.82,9.2 34.12,12.5 IC2.3 | DC1.1 49.49,7.17 47.71,7.17 41.11,13.77 35.77,13.77 IC2.3 | 46.12,76.45 46.95,77.27 X3.4 47.2,77.53 49.62,79.94 54.19,79.94 X3.SH1 | 46.12,76.45 45.55,75.87 45.55,74.86 45.68,74.73 45.68,71.18 C10.1 | 32.79,81.65 34.38,80.07 42.12,80.07 X3.SH2 42.5,80.07 46.12,76.45 | 32.79,81.65 31.33,83.11 MODE_SW.1 | 32.79,81.65 29.8,78.67 21.04,78.67 19.77,79.94 15.2,79.94 OK-BUTTON.3 | U1.7 117.05,57.33 117.05,55.05 U1.8 117.05,54.79 117.05,52.51 U1.9 117.05,52.25 117.05,49.97 U1.10 117.18,49.71 118.7,48.19 118.7,36.38 117.18,34.85 117.18,34.6 U1.16 116.8,34.47 107.66,25.33 106.77,25.33 105.62,24.19 96.61,24.19 PCB1.GND.... | 89.43,78.61 91.4,80.57 C6.- | 89.43,78.61 86.07,75.24 | 86.07,75.24 82,71.18 PWR.K | 86.07,75.24 90.13,71.18 C8.2 | Q1.E 118.07,78.8 116.16,80.7 101.81,80.7 101.69,80.57 C7.- | R6.1 64.86,83.11 80.73,83.11 85.05,78.8 89.24,78.8 89.43,78.61
JACK_USB_V+
  Top 0.6: D1.A 59.65,15.17 54.57,10.09 DC1.2
N$1
  Top 0.203: Q1.C 112.99,78.67 109.69,78.67 106.77,75.75 SG1.-
N$2  (via drill 0.3)
  Top 0.203: v115.91,20.63 115.91,28.12 119.85,32.06 v119.85,74.48
  Bottom 0.203: v115.91,20.63 114.39,19.11 R9.2 | v119.85,74.48 115.66,78.67 Q1.B
N$3  (via drill 0.3)
  Top 0.203: v19.26,68.76 19.9,69.4 37.42,69.4 46.57,78.54 49.74,78.54 50.38,77.91 55.2,77.91 56.35,79.05 56.35,79.18 57.11,79.94 R3.2
  Bottom 0.203: v19.26,68.76 18.37,68.76 17.23,67.62 17.23,63.05 8.47,54.28 8.47,14.41 20.41,2.47 20.41,1.45 21.04,0.82 25.87,0.82 26.63,1.58 26.63,2.47 27.65,3.48 32.98,3.48 33.87,2.6 35.65,2.6 36.79,3.74 POWER-LED.K
N$4
  Top 0.203: R4.2 21.68,79.94 21.68,73.72 HW-MODE.K
  Bottom 0.203: SW-MODE.A 38.06,73.72 37.17,73.72 36.03,74.86 22.82,74.86 21.68,73.72 HW-MODE.K
N$5  (via drill 0.3)
  Top 0.203: v84.67,76.38 86.07,76.38 87.59,77.91 87.59,78.67 93.18,84.26 114.77,84.26 119.21,79.81 119.21,32.82 116.93,30.54 R11.2
  Bottom 0.203: v84.67,76.38 79.46,71.18 PWR.A
N$6  (via drill 0.3)
  Top 0.203: v73.87,77.91 70.83,80.95 70.06,80.95 IC1.2 | v43.77,69.4 v46.82,69.4
  Bottom 0.203: v73.87,77.91 73.87,74.35 73.49,73.97 69.05,73.97 65.11,77.91 50.38,77.91 49.87,78.41 49.11,78.41 48.47,77.78 48.47,74.86 49.36,73.97 49.36,71.94 v46.82,69.4 | v43.77,69.4 43.77,60.51 47.97,56.32 47.97,52.25 43.27,47.55 41.11,47.55 40.35,46.79 40.35,39.81 42.89,37.27 42.89,31.17 32.09,20.38 26.76,20.38 25.49,19.11 CRS.1
N$9  (via drill 0.3)
  Top 0.203: v75.65,73.84 77.3,73.84 IC1.16
  Bottom 0.203: v75.65,73.84 74.38,72.57 55.97,72.57 53.3,75.24 49.62,75.24 X3.2
N$24  (via drill 0.3)
  Top 0.203: v74.13,73.21 77.3,73.21 IC1.15
  Bottom 0.203: v74.13,73.21 62.95,73.21 60.54,75.62 53.55,75.62 51.9,77.27 49.62,77.27 X3.3
N$34
  Top 0.203: TX.A 85.81,77.53 85.81,81.21 87.72,83.11 R12.2
N$36
  Top 0.203: R13.2 57.24,76.89 60.28,76.89 62.32,78.92 65.49,78.92 70.19,83.62 84.67,83.62 85.68,82.61 RX.A
N-PRINTING
  Top 0.203: X1.11 79.08,12.76 77.94,12.76 73.49,17.2 73.11,17.2 70.44,19.87 70.44,61.52 76.16,67.24 PCB1.17
RESET
  Top 0.203: CRS.2 20.28,18.98 20.28,13.77 RESET.1 20.28,13.64 26.63,13.64 RESET.2 26.76,13.77 27.77,13.77 32.98,18.98 PCB1.RESET
  Bottom 0.203: R1.1 39.46,78.67 39.46,74.6 44.41,69.65 44.41,66.35 52.41,58.35 52.41,33.2 47.71,28.5 44.79,28.5 36.66,20.38 34.38,20.38 33.11,19.11 PCB1.RESET
RX
  Top 0.203: JP2.2 61.05,73.59 61.05,72.57 63.46,70.16 63.46,67.37 PCB1.0
RXD
  Top 0.203: IC1.5 69.94,79.05 68.41,79.05 64.09,74.73 59.52,74.73 58.51,73.72 JP2.1
RXLED
  Top 0.203: IC1.22 77.43,77.78 82.89,77.78 83.14,77.53 TX.K
SPDT_EXT  (via drill 0.3)
  Top 0.203: v104.23,66.6 101.69,69.14 101.69,76.89 C7.+ | v104.23,54.28 104.23,54.03 114.77,43.49 114.77,27.61 115.28,27.11 115.28,17.07 99.65,1.45 v99.65,1.33
  Bottom 0.203: IC2.2 41.74,10.34 44.41,7.68 USB_EXT.1 44.54,7.55 50.76,1.33 v99.65,1.33 | v104.23,54.28 v104.23,66.6
SPDT_IN
  Bottom 0.203: POWER_SW.2 23.58,1.96 23.96,1.96 27.01,5.01 44.41,5.01 USB_EXT.2
TX
  Top 0.203: JP2.3 58.51,71.05 58.51,69.78 60.92,67.37 PCB1.1
TXD
  Top 0.203: IC1.1 69.94,81.59 68.79,81.59 65.11,77.91 61.94,77.91 58.76,74.73 57.87,74.73 57.24,74.1 57.24,73.33 58.38,72.19 59.9,72.19 60.92,71.18 JP2.4
TXLED
  Top 0.203: IC1.23 77.43,78.54 79.21,78.54 83.14,82.48 RX.K
USB_V+
  Bottom 0.6: F1.P$1 48.22,72.45 48.22,74.1 47.08,75.24 X3.1
USB_V++  (via drill 0.3)
  Top 0.6: v46.06,17.2 42.25,13.39 42.25,4.5 44.16,2.6 44.41,2.6 USB_EXT.3
  Bottom 0.6: 67.78,69.65 90.51,69.65 91.53,70.67 91.53,72.32 C4.2 | 67.78,69.65 57.87,69.65 55.2,72.32 53.43,72.32 F1.P$2 | v46.06,17.2 49.49,20.63 49.49,29.27 54.57,34.35 54.57,58.48 61.81,65.71 64.09,65.71 67.78,69.4 67.78,69.65
V0
  Bottom 0.203: R2.2 108.04,58.48 108.04,58.86 116.67,67.49 117.05,67.49 U1.3
VIN
  Top 0.203: JP_VIN.1 46.95,11.49 46.95,11.74 45.04,13.64 45.04,15.17 46.82,16.95 46.82,17.96 45.81,18.98 PCB1.VIN
VIN_DIRECT
  Top 0.203: D1.C 49.49,15.17 48.22,15.17 47.08,14.03 JP_VIN.2
  Bottom 0.203: IC2.1 41.74,14.91 46.06,14.91 46.95,14.03 JP_VIN.2 | C6.+ 91.53,77.02 95.72,81.21 96.48,81.21 C5.2 96.61,81.21 98.51,79.3 101.43,79.3 106.13,74.6 117.69,74.6 119.47,72.83 119.47,22.03 105.88,8.44 64.6,8.44 57.87,15.17 49.62,15.17 D1.C
(copper drawn outside any net)
  shapes: Bottom area x7341

### Text on the board
Bottom: C:/Users/gowrav/Downloads/documents-export-2015-09-12/EagleLogo_Flipped.bmp
tPlace: Designed By: | C:/Users/gowrav/Downloads/documents-export-2015-09-12/EagleLogo.bmp | GeekSynergy | GeekSynergy Technologies Pvt. Ltd. | C:/Users/gowrav/Downloads/documents-export-2015-09-12/AGTex.bmp | GuruBramha Technologies
bStop: C:/Users/gowrav/Downloads/documents-export-2015-09-12/EagleLogo_Flipped.bmp